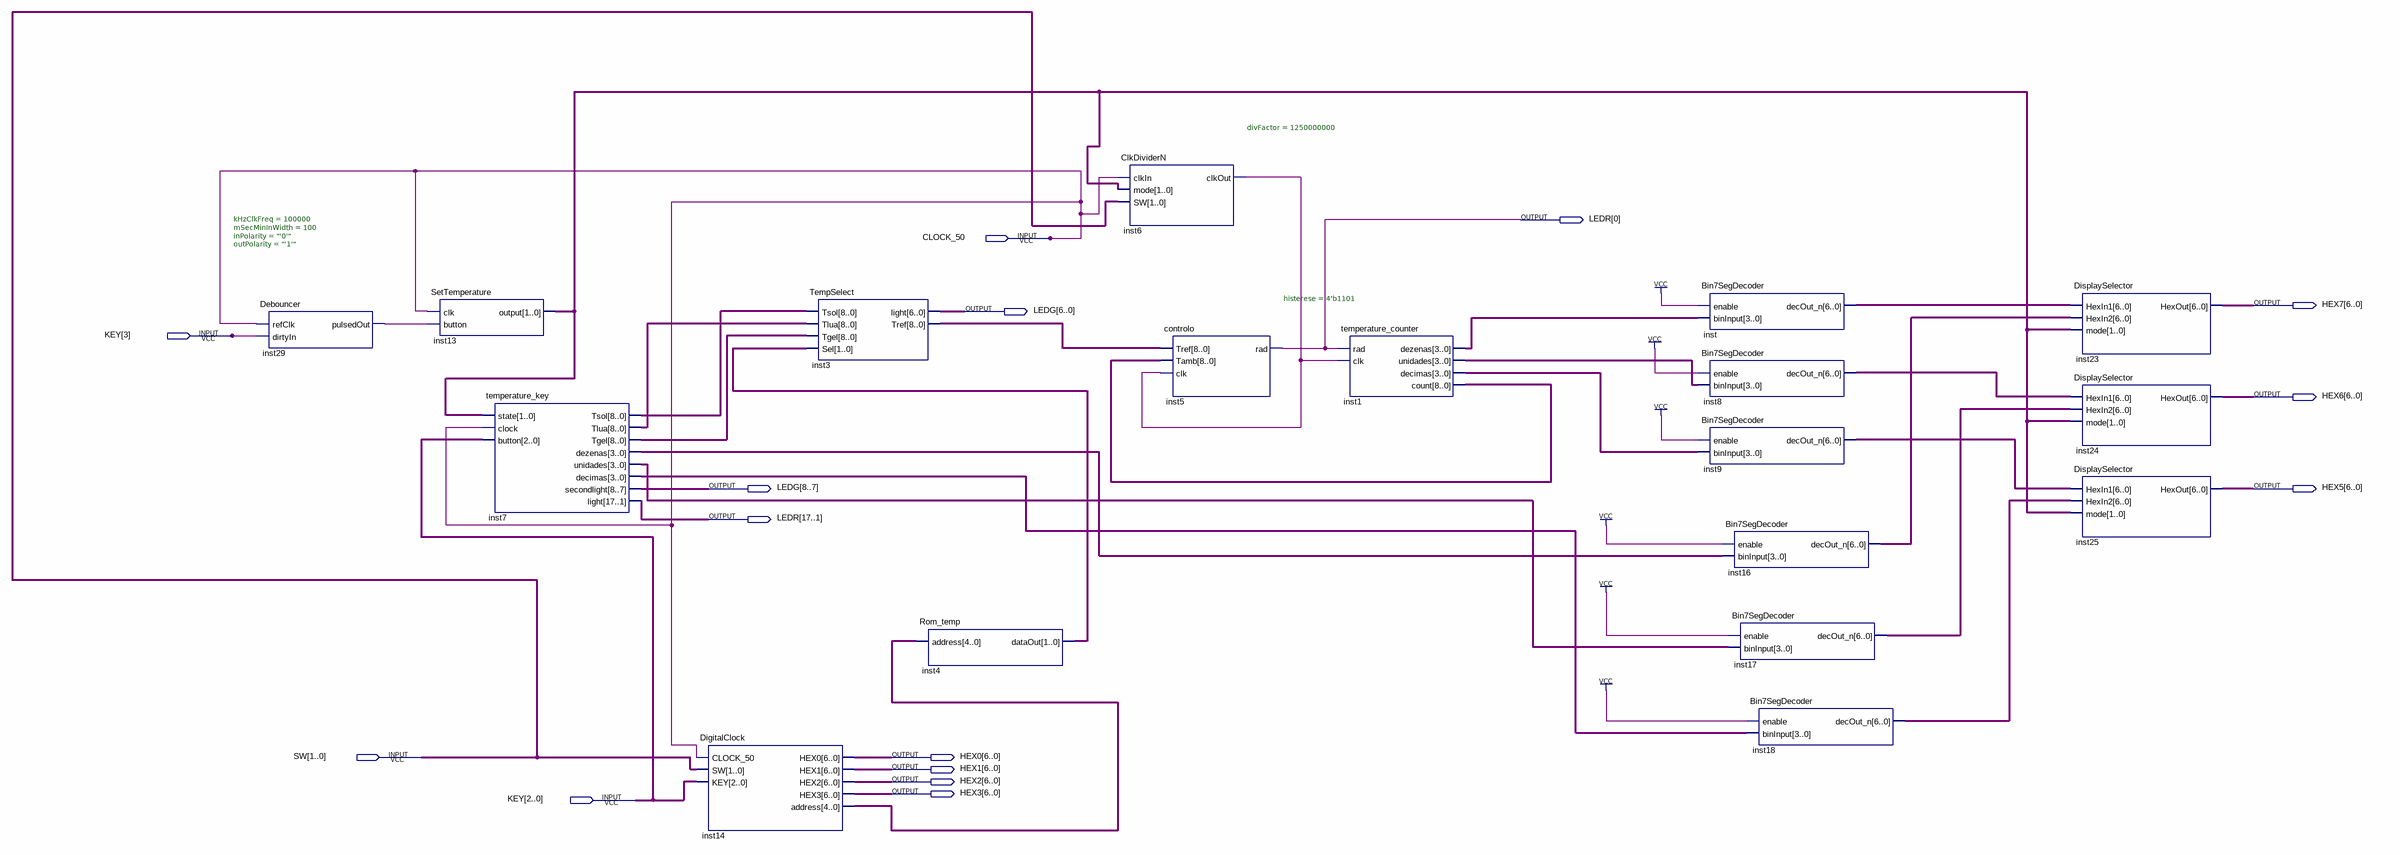
[diagram p0: schematic sheet]
// Quartus schematic main.bdf as structural Verilog: 18 symbols, 15 pins
module main (
  input  CLOCK_50,
  input  [3:0] KEY,
  input  [1:0] SW,
  output [17:0] LEDR,
  output [6:0] HEX7,
  output [8:0] LEDG,
  output [6:0] HEX6,
  output [6:0] HEX5,
  output [6:0] HEX0,
  output [6:0] HEX1,
  output [6:0] HEX2,
  output [6:0] HEX3
);

  wire inst6_clkout, inst29_pulsedout;
  wire [1:0] inst4_dataout, inst13_output;
  wire [3:0] inst1_decimas, inst1_dezenas, inst1_unidades, inst7_decimas, inst7_dezenas, inst7_unidades;
  wire [4:0] inst14_address;
  wire [6:0] inst8_decout_n, inst9_decout_n, inst16_decout_n, inst17_decout_n, inst18_decout_n, inst_decout_n;
  wire [8:0] inst1_count, inst3_tref, inst7_tgel, inst7_tlua, inst7_tsol;

  Debouncer #(.kHzClkFreq(100000), .mSecMinInWidth(100), .inPolarity("'0'"), .outPolarity("'1'")) inst29 (
    .refClk(CLOCK_50), .dirtyIn(KEY[3]), .pulsedOut(inst29_pulsedout));
  SetTemperature inst13 (.clk(CLOCK_50), .button(inst29_pulsedout), .\output (inst13_output));
  temperature_key inst7 (
    .state(inst13_output), .clock(CLOCK_50), .button(KEY[2:0]), .Tsol(inst7_tsol), .Tlua(inst7_tlua),
    .Tgel(inst7_tgel), .dezenas(inst7_dezenas), .unidades(inst7_unidades), .decimas(inst7_decimas),
    .secondlight(LEDG[8:7]), .light(LEDR[17:1]));
  DigitalClock inst14 (
    .CLOCK_50(CLOCK_50), .SW(SW), .KEY(KEY[2:0]), .HEX0(HEX0), .HEX1(HEX1), .HEX2(HEX2), .HEX3(HEX3),
    .address(inst14_address));
  TempSelect inst3 (
    .Tsol(inst7_tsol), .Tlua(inst7_tlua), .Tgel(inst7_tgel), .Sel(inst4_dataout), .light(LEDG[6:0]),
    .Tref(inst3_tref));
  Rom_temp inst4 (.address(inst14_address), .dataOut(inst4_dataout));
  ClkDividerN #(.divFactor(1250000000)) inst6 (.clkIn(CLOCK_50), .mode(inst13_output), .SW(SW), .clkOut(inst6_clkout));
  controlo #(.histerese(4'b1101)) inst5 (.Tref(inst3_tref), .Tamb(inst1_count), .clk(inst6_clkout), .rad(LEDR[0]));
  temperature_counter inst1 (
    .rad(LEDR[0]), .clk(inst6_clkout), .dezenas(inst1_dezenas), .unidades(inst1_unidades),
    .decimas(inst1_decimas), .count(inst1_count));
  Bin7SegDecoder inst (.enable(1'b1), .binInput(inst1_dezenas), .decOut_n(inst_decout_n));
  Bin7SegDecoder inst8 (.enable(1'b1), .binInput(inst1_unidades), .decOut_n(inst8_decout_n));
  Bin7SegDecoder inst9 (.enable(1'b1), .binInput(inst1_decimas), .decOut_n(inst9_decout_n));
  Bin7SegDecoder inst16 (.enable(1'b1), .binInput(inst7_dezenas), .decOut_n(inst16_decout_n));
  Bin7SegDecoder inst17 (.enable(1'b1), .binInput(inst7_unidades), .decOut_n(inst17_decout_n));
  Bin7SegDecoder inst18 (.enable(1'b1), .binInput(inst7_decimas), .decOut_n(inst18_decout_n));
  DisplaySelector inst23 (.HexIn1(inst_decout_n), .HexIn2(inst16_decout_n), .mode(inst13_output), .HexOut(HEX7));
  DisplaySelector inst24 (.HexIn1(inst8_decout_n), .HexIn2(inst17_decout_n), .mode(inst13_output), .HexOut(HEX6));
  DisplaySelector inst25 (.HexIn1(inst9_decout_n), .HexIn2(inst18_decout_n), .mode(inst13_output), .HexOut(HEX5));
endmodule
